# EAGLE design cartrack (EAGLE 6.6.0)
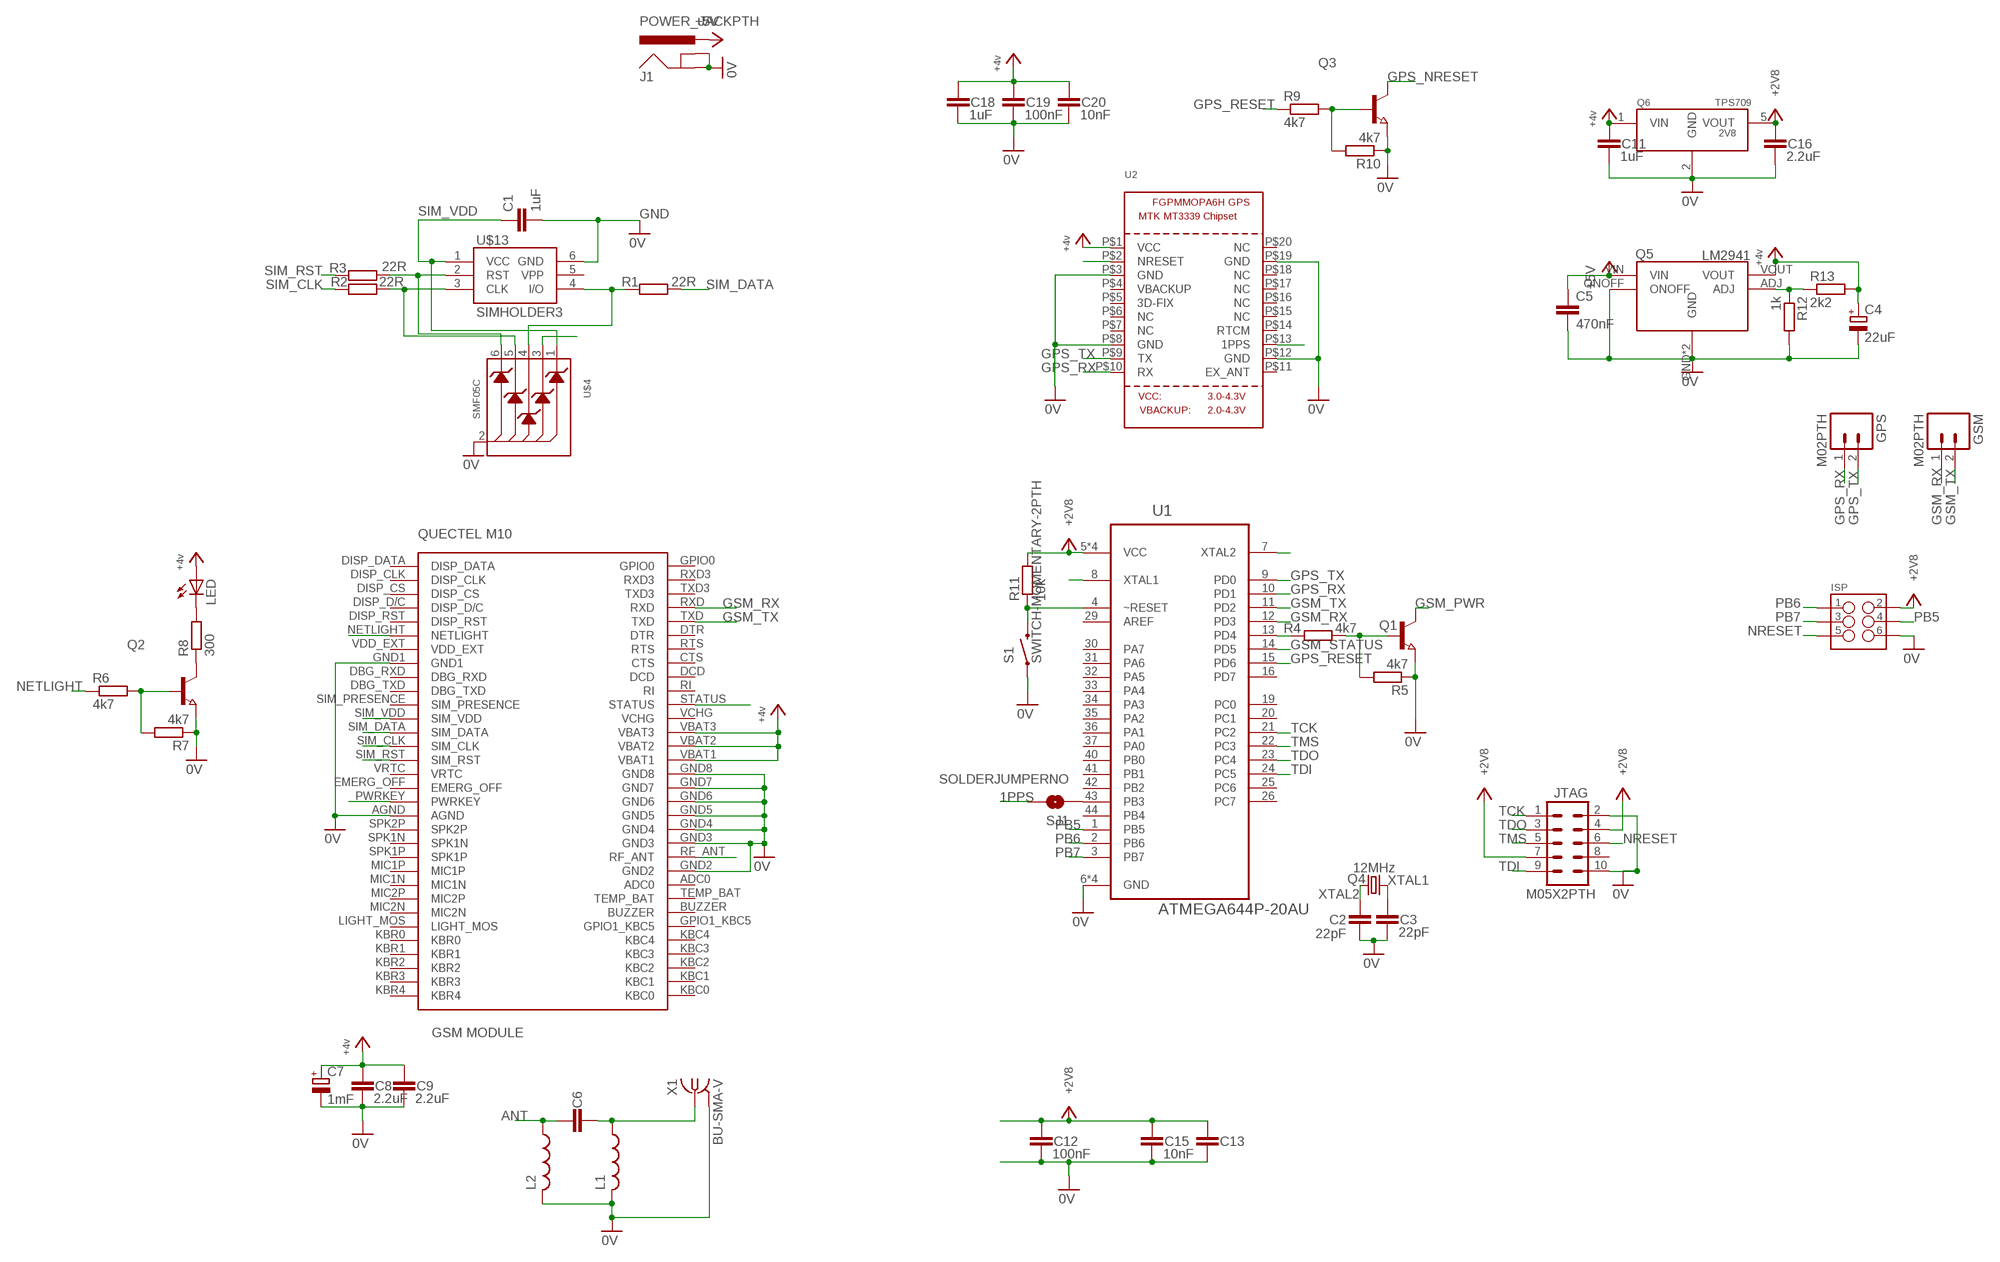
[diagram p0: schematic, sheet 1]

## Parts
C1  1uF  C-EUC0603  [C0603]
C2  22pF  CAP0603-CAP  [0603-CAP]
C3  22pF  CAP0603-CAP  [0603-CAP]
C4  22uF  CPOL-EUE3.5-8  [E3,5-8]
C5  470nF  C-EU025-024X044  [C025-024X044]
C6  CAP0603-CAP  [0603-CAP]
C7  1mF  CPOL-EUE3.5-8  [E3,5-8]
C8  2.2uF  CAP1206  [1206]
C9  2.2uF  CAP1206  [1206]
C11  1uF  CAP1206  [1206]
C12  100nF  CAP1206  [1206]
C13  CAP0603-CAP  [0603-CAP]
C15  10nF  CAP0603-CAP  [0603-CAP]
C16  2.2uF  CAP1206  [1206]
C18  1uF  CAPPTH  [CAP-PTH-SMALL]
C19  100nF  CAP1206  [1206]
C20  10nF  CAP0603-CAP  [0603-CAP]
GPS  M02PTH  [1X02]
GSM  M02PTH  [1X02]
ISP  M03X2NO_SILK  [2X3-NS]
J1  POWER_JACKPTH  [POWER_JACK_PTH]
JTAG  M05X2PTH  [AVR_ICSP]
L1  L-USL2012C  [L2012C]
L2  L-USL2012C  [L2012C]
LED  LEDSML0603  [SML0603]
Q1  NPN-TRANSISTOR_SOT23W  [SOT23W]
Q2  NPN-TRANSISTOR_SOT23W  [SOT23W]
Q3  NPN-TRANSISTOR_SOT23W  [SOT23W]
Q4  12MHz  CRYSTALSM49  [SM49]
Q5  LM2941  [LM2941]
Q6  TPS70928  [SOT23-5]
R1  22R  R-EU_R0603  [R0603]
R2  22R  R-EU_R0603  [R0603]
R3  22R  R-EU_R0603  [R0603]
R4  4k7  R-EU_R0603  [R0603]
R5  4k7  R-EU_R0603  [R0603]
R6  4k7  R-EU_R0603  [R0603]
R7  4k7  R-EU_R0603  [R0603]
R8  300  R-EU_R0603  [R0603]
R9  4k7  R-EU_R0603  [R0603]
R10  4k7  R-EU_R0603  [R0603]
R11  10k  R-EU_R0603  [R0603]
R12  1k  R-EU_R0603  [R0603]
R13  2k2  R-EU_R0603  [R0603]
S1  SWITCH-MOMENTARY-2PTH  [TACTILE-PTH]
SJ1  SOLDERJUMPERNO  [SJ_2S-NO]
U1  ATMEGA644P-20AU  [QFP80P1200X1200X120-44N]
U2  GPS_FGPMMOPA6H  [FGPMMOPA6H]
U$1  QUECTELM10  [QUECTELM10]
U$4  SMF05C  [SC-88]
U$13  SIMHOLDER3  [SIMHOLDER3]
X1  BU-SMA-V  [BU-SMA-V]

## Nets
1PPS: SJ1.2 U2.P$13(1PPS)
+2V8: C12.1 C13.1 C15.1 C16.1 ISP.2 JTAG.4 JTAG.7 Q6.5(VOUT) R11.2 U1.5(VCC) U1.17(VCC) U1.27(VCC) U1.38(VCC)
+4V: C4.+ C7.+ C8.1 C9.1 C11.1 C18.1 C19.1 C20.1 LED.A Q5.VOUT Q6.1(VIN) R13.2 U2.P$1(VCC) U$1.VBAT1 U$1.VBAT2 U$1.VBAT3
+5V: C5.1 J1.PWR Q5.VIN
ANT: C6.1 L2.1 U$1.RF_ANT
ANT_1: C6.2 L1.1 X1.1
GND: C1.2 C2.2 C3.2 C4.- C5.2 C7.- C8.2 C9.2 C11.2 C12.2 C13.2 C15.2 C16.2 C18.2 C19.2 C20.2 ISP.6 J1.GND J1.GNDBREAK JTAG.2 JTAG.10 L1.2 L2.2 Q1.3(E) Q2.3(E) Q3.3(E) Q5.GND Q5.ONOFF Q5.TAB(GND) Q6.2(GND) R5.1 R7.1 R10.1 R12.2 S1.1 U2.P$3(GND) U2.P$8(GND) U2.P$12(GND) U2.P$19(GND) U$1.AGND U$1.GND1 U$1.GND2 U$1.GND3 U$1.GND4 U$1.GND5 U$1.GND6 U$1.GND7 U$1.GND8 U$4.2(ANODE) U$13.6(GND) X1.2 X1.3 X1.4 X1.5 ; supply symbol labelled 0V
GPS_NRESET: Q3.2(C) U2.P$2(NRESET)
GPS_RESET: R9.1 U1.15(PD6)
GPS_RX: GPS.1 U1.10(PD1) U2.P$10(RX)
GPS_TX: GPS.2 U1.9(PD0) U2.P$9(TX)
GSM_PWR: Q1.2(C) U$1.PWRKEY U$4.3(CATODE2)
GSM_RX: GSM.1 U1.12(PD3) U$1.RXD
GSM_STATUS: U1.14(PD5) U$1.STATUS
GSM_TX: GSM.2 U1.11(PD2) U$1.TXD
N$5: Q1.1(B) R4.2 R5.2
N$6: R4.1 U1.13(PD4)
N$7: Q5.ADJ R12.1 R13.1
N$8: Q2.1(B) R6.2 R7.2
N$9: Q2.2(C) R8.1
N$10: LED.C R8.2
N$11: Q3.1(B) R9.2 R10.2
N$13: SJ1.1 U1.43(PB3)
NETLIGHT: R6.1 U$1.NETLIGHT
NRESET: ISP.5 JTAG.6 R11.1 S1.3 U1.4(~RESET)
PB5: ISP.4 U1.1(PB5)
PB6: ISP.1 U1.2(PB6)
PB7: ISP.3 U1.3(PB7)
SIM_CLK: R2.1 U$1.SIM_CLK
SIM_CLK_R: R2.2 U$4.5(CATODE4) U$13.3(CLK)
SIM_DATA: R1.2 U$1.SIM_DATA
SIM_DATA_R: R1.1 U$4.4(CATODE3) U$13.4(I/O)
SIM_RST: R3.1 U$1.SIM_RST
SIM_RST_R: R3.2 U$4.6(CATODE5) U$13.2(RST)
SIM_VDD: C1.1 U$1.SIM_VDD U$4.1(CATODE1) U$13.1(VCC)
TCK: JTAG.1 U1.21(PC2)
TDI: JTAG.9 U1.24(PC5)
TDO: JTAG.3 U1.23(PC4)
TMS: JTAG.5 U1.22(PC3)
XTAL1: C3.1 Q4.2 U1.8(XTAL1)
XTAL2: C2.1 Q4.1 U1.7(XTAL2)
Unconnected: JTAG.8 U1.6(GND) U1.16(PD7) U1.18(GND) U1.19(PC0) U1.20(PC1) U1.25(PC6) U1.26(PC7) U1.28(GND) U1.29(AREF) U1.30(PA7) U1.31(PA6) U1.32(PA5) U1.33(PA4) U1.34(PA3) U1.35(PA2) U1.36(PA1) U1.37(PA0) U1.39(GND) U1.40(PB0) U1.41(PB1) U1.42(PB2) U1.44(PB4) U2.P$4(VBACKUP) U2.P$5(3D-FIX) U2.P$6(NC) U2.P$7(NC) U2.P$11(EX_ANT) U2.P$14(RTCM) U2.P$15(NC) U2.P$16(NC) U2.P$17(NC) U2.P$18(NC) U2.P$20(NC) U$1.ADC0 U$1.BUZZER U$1.CTS U$1.DBG_RXD U$1.DBG_TXD U$1.DCD U$1.DISP_CLK U$1.DISP_CS U$1.DISP_D/C U$1.DISP_DATA U$1.DISP_RST U$1.DTR U$1.EMERG_OFF U$1.GPIO0 U$1.GPIO1_KBC5 U$1.KBC0 U$1.KBC1 U$1.KBC2 U$1.KBC3 U$1.KBC4 U$1.KBR0 U$1.KBR1 U$1.KBR2 U$1.KBR3 U$1.KBR4 U$1.LIGHT_MOS U$1.MIC1N U$1.MIC1P U$1.MIC2N U$1.MIC2P U$1.RI U$1.RTS U$1.RXD3 U$1.SIM_PRESENCE U$1.SPK1N U$1.SPK1P U$1.SPK2P U$1.TEMP_BAT U$1.TXD3 U$1.VCHG U$1.VDD_EXT U$1.VRTC U$13.5(VPP)

## Library data of the parts
C1 C5 = resistor:C-EU: CAPACITOR, European symbol
C2 C3 C6 C8 C9 C11-C13 C15 C16 C18-C20 = SparkFun-Passives:CAP: Capacitor Standard 0603 ceramic capacitor, and 0.1" leaded capacitor.
C4 C7 = resistor:CPOL-EU: POLARIZED CAPACITOR, European symbol
GPS GSM = SparkFun-Connectors:M02: Standard 2-pin 0.1" header. Use with - straight break away headers ( PRT-00116) - right angle break away headers (PRT-00553) - swiss pins (PRT-00743) - machine pins (PRT-00117) - female headers (PRT-00115) Molex polarized connector foot print use with: PRT-08233 with associated crimp pins and housings. 2.54_SCREWTERM for use with PRT-10571. 3.5mm Screw Terminal footprints for PRT-08084 5mm Screw Terminal footprints for use with PRT-08433
ISP = SparkFun-Connectors:M03X2: 2x3 .1" header. Shrouded, with keying- CONN-10681 SMT- CONN-11415 Pogo pins- HW-11044
J1 = SparkFun-Connectors:POWER_JACK: Power Jack This is the standard 5.5mm barrel jack for power. The PTH is the most common, proven, reliable, footprint. The Slot footprint only works if the mill layer is transmitted to the PCB fab house so be warned. Mating wall wart : TOL-00298 (and others); PROD_ID: PRT-00119
JTAG = SparkFun-Connectors:M05X2: Header 5x2 Standard 10-pin dual row 0.1" header. Commonly used with AVR-ISP. Use with Spark Fun Electronics SKU: PRT-00778
L1 L2 = resistor:L-US: INDUCTOR, American symbol
LED = led:LED: LED OSRAM: - CHIPLED LG R971, LG N971, LY N971, LG Q971, LY Q971, LO R971, LY R971 LH N974, LH R974 LS Q976, LO Q976, LY Q976 LO Q996 - Hyper CHIPLED LW Q18S LB Q993, LB Q99A, LB R99A - SideLED LS A670, LO A670, LY A670, LG A670, LP A670 LB A673, LV A673, LT A673, LW A673 LH A674 LY A675 LS A676, LA A676, LO A676, LY A676, LW A676 LS A679, LY A679, LG A679 - Hyper Micro SIDELED® LS Y876, LA Y876, LO Y876, LY Y876 LT Y87S - SmartLED LW L88C, LW L88S LB L89C, LB L89S, LG L890 LS L89K, LO L89K, LY L89K LS L896, LA L896, LO L896, LY L896 - TOPLED LS T670, LO T670, LY T670, LG T670, LP T670 LSG T670, LSP T670, LSY T670, LOP T670, LYG T670 LG T671, LOG T671, LSG T671 LB T673, LV T673, LT T673, LW T673 LH T674 LS T676, LA T676, LO T676, LY T676, LB T676, LH T676, LSB T676, LW T676 LB T67C, LV T67C, LT T67C, LS T67K, LO T67K, LY T67K, LW E67C LS E67B, LA E67B, LO E67B, LY E67B, LB E67C, LV E67C, LT E67C LW T67C LS T679, LY T679, LG T679 LS T770, LO T770, LY T770, LG T770, LP T770 LB T773, LV T773, LT T773, LW T773 LH T774 LS E675, LA E675, LY E675, LS T675 LS T776, LA T776, LO T776, LY T776, LB T776 LHGB T686 LT T68C, LB T68C - Hyper Mini TOPLED® LB M676 - Mini TOPLED Santana® LG M470 LS M47K, LO M47K, LY M47K Source: http://www.osram.convergy.de LUXEON: - LUMILED® LXK2-PW12-R00, LXK2-PW12-S00, LXK2-PW14-U00, LXK2-PW14-V00 LXK2-PM12-R00, LXK2-PM12-S00, LXK2-PM14-U00 LXK2-PE12-Q00, LXK2-PE12-R00, LXK2-PE12-S00, LXK2-PE14-T00, LXK2-PE14-U00 LXK2-PB12-K00, LXK2-PB12-L00, LXK2-PB12-M00, LXK2-PB14-N00, LXK2-PB14-P00, LXK2-PB14-Q00 LXK2-PR12-L00, LXK2-PR12-M00, LXK2-PR14-Q00, LXK2-PR14-R00 LXK2-PD12-Q00, LXK2-PD12-R00, LXK2-PD12-S00 LXK2-PH12-R00, LXK2-PH12-S00 LXK2-PL12-P00, LXK2-PL12-Q00, LXK2-PL12-R00 Source: www.luxeon.com KINGBRIGHT: KA-3528ASYC Source: www.kingbright.com
Q1-Q3 = semicon-smd-ipc:NPN-TRANSISTOR_: NPN TRANSISTOR
Q4 = crystal:CRYSTAL: CRYSTAL; OC_FARNELL: unknown; OC_NEWARK: unknown
Q5 = misc:LM2941: Voltage Regulator
Q6 = misc:TPS70928
R1-R13 = resistor:R-EU_: RESISTOR, European symbol
S1 = SparkFun-Electromechanical:SWITCH-MOMENTARY-2: Various NO switches- pushbuttons, reed, etc
SJ1 = SparkFun-Retired:SOLDERJUMPER: Solder Jumper Standard SMD solder jumper. Used to automate production. Two varients : Normally Open and Normally Closed are the same, but have different paste layers. NC will have a large amount of paste and should jumper during reflow.
U1 = Atmel_By_element14_Batch_1:ATMEGA644P-20AU: 8-bit Microcontroller with Bytes In-System Programmable Flash; MPN: ATMEGA644P-20AU; OC_FARNELL: 1455121; OC_NEWARK: 58M3746; PACKAGE: TQFP-44; SUPPLIER: Atmel
U2 = adafruit:GPS_FGPMMOPA6H: GPS Module - MTK MT3339 Chipset, -165dBm sensitivity, 22 channels, 10Hz, auto-select external antenna options
U$1 = quectelm10:QUECTELM10: Quectel M10 GSM module by RobotSzoft Kft
U$4 = Simplex-DiscreteSemi:SMF05C: ON Semiconductor SMF05C 5-line transient voltage suppressor array
U$13 = SparkFun-Connectors:SIMHOLDER3: Alternate SIM card socket
X1 = con-coax:BU-SMA-V: FEMALE SMA CONNECTOR Radiall distributor RS 112-3794; OC_FARNELL: unknown; OC_NEWARK: unknown

## Board
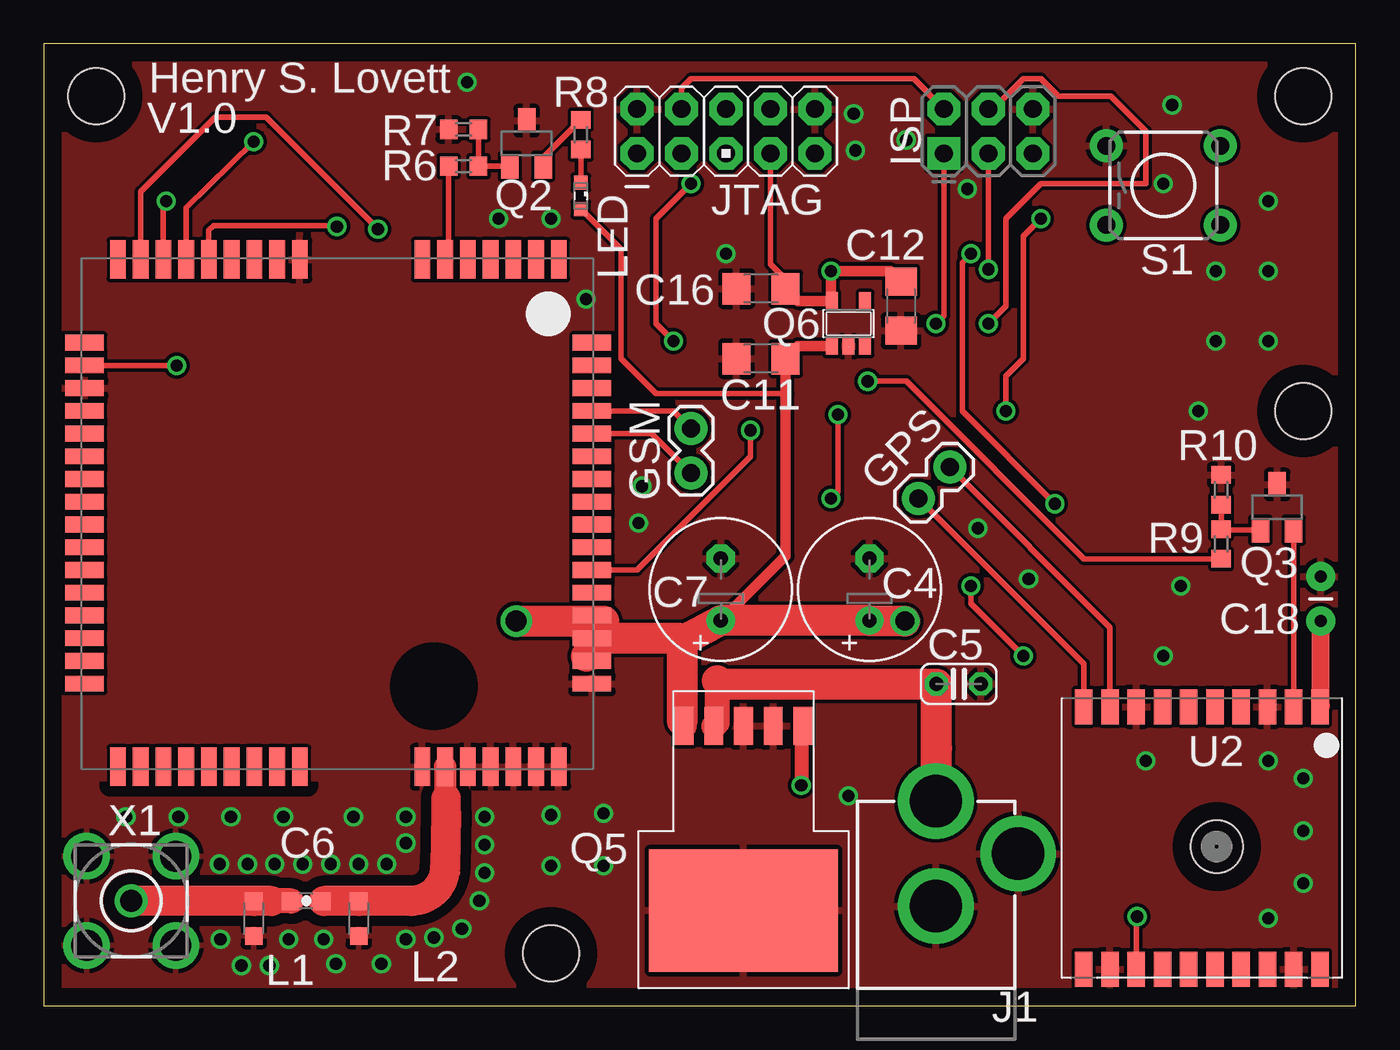
[diagram p1: board, top side]
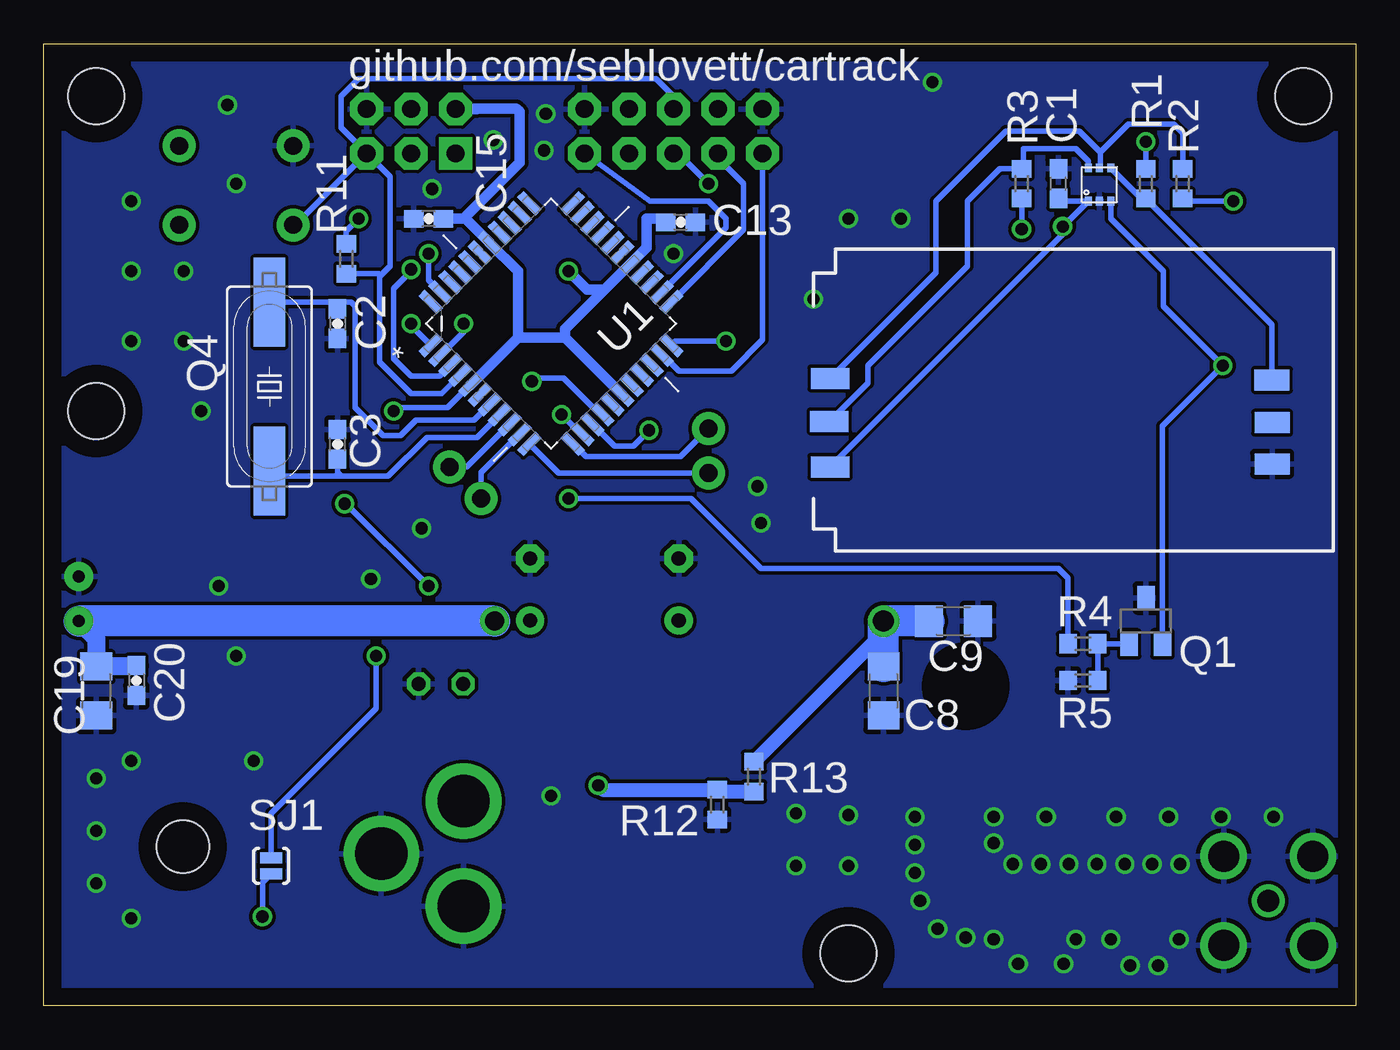
[diagram p2: board, bottom side, seen from below]

Size 75 x 55 mm. Coordinates in mm from the lower left corner, seen from the top.
Outline: 0,0 75,0 75,55 0,55 0,0
Copper layers (1*16): Top 0.035mm / dielectric 1.5mm / Bottom 0.035mm
Design rules "default": minimum track width 10mil, minimum drill 24mil, track to track 8mil, track to pad 8mil, pad to pad 8mil, via to via 8mil, smd to smd 8mil, copper to edge 40mil, drill to drill 8mil, minimum pad ring 10mil, minimum via ring 8mil, stop-mask expansion 4mil, vias tented up to drill 0mil, thermal gap 10mil
Holes 3.2 mm at 3,52 72,52 72,34 29,3

### Footprints (pad centres in the part's own frame; a part is rotated, then mirrored left to right if it is on the bottom)
C0603 = smd 1.1 x 1: 1 -0.85,0; 2 0.85,0
0603-CAP = smd 1.1 x 1: 1 -0.85,0; 2 0.85,0
E3,5-8 = drill 0.813 pad 1.6: + -1.778,0 | drill 0.813 pad 1.6 octagon: - 1.778,0
C025-024X044 = drill 0.813 octagon: 1 -1.27,0; 2 1.27,0
1206 = smd 1.6 x 1.8: 1 -1.4,0; 2 1.4,0
CAP-PTH-SMALL = drill 0.7 pad 1.651: 1 0,0; 2 2.54,0
1X02 = drill 1.016 pad 1.88: 1 0,0; 2 2.54,0
2X3-NS = drill 1.016 pad 1.88 square: 1 -2.54,-1.27 | drill 1.016 pad 1.88 octagon: 2 -2.54,1.27; 3 0,-1.27; 4 0,1.27; 5 2.54,-1.27; 6 2.54,1.27
POWER_JACK_PTH = drill 2.997 pad 4.318: GND 0,7.7; GNDBREAK 4.7,10.7; PWR 0,13.7
AVR_ICSP = drill 1.016 pad 1.88 octagon: 1 -1.27,5.08; 2 1.27,5.08; 3 -1.27,2.54; 4 1.27,2.54; 5 -1.27,0; 6 1.27,0; 7 -1.27,-2.54; 8 1.27,-2.54; 9 -1.27,-5.08; 10 1.27,-5.08
L2012C = smd 1 x 1: 1 -1,0; 2 1,0
SML0603 = smd 0.8 x 0.8: A 0.75,0; C -0.75,0
SOT23W = smd 1 x 1.4: 1 -0.95,-1.303; 2 0.95,-1.303; 3 0,1.303
SM49 = smd 5.08 x 1.778: 1 -4.826,0; 2 4.826,0
LM2941 = smd 2.184 x 1.067: ADJ 7,-3.4; GND 7,0; ONOFF 7,-1.7; VIN 7,1.7; VOUT 7,3.4 | smd 6.985 x 10.795: TAB -3.556,0
SOT23-5 = smd 0.69 x 0.99: 1 -0.95,-1.29; 2 0,-1.29; 3 0.95,-1.29; 4 0.95,1.3; 5 -0.95,1.3
R0603 = smd 1 x 1.1: 1 -0.85,0; 2 0.85,0
TACTILE-PTH = drill 1.016 pad 1.88: 1 -3.251,2.261; 2 3.251,2.261; 3 -3.251,-2.261; 4 3.251,-2.261
SJ_2S-NO = smd 0.635 x 1.27: 1 -0.45,0; 2 0.45,0
QFP80P1200X1200X120-44N = smd 1.473 x 0.508: 1 -5.74,3.988; 2 -5.74,3.2; 3 -5.74,2.388; 4 -5.74,1.6; 5 -5.74,0.787; 6 -5.74,0; 7 -5.74,-0.787; 8 -5.74,-1.6; 9 -5.74,-2.388; 10 -5.74,-3.2; 11 -5.74,-3.988; 23 5.74,-3.988; 24 5.74,-3.2; 25 5.74,-2.388; 26 5.74,-1.6; 27 5.74,-0.787; 28 5.74,0; 29 5.74,0.787; 30 5.74,1.6; 31 5.74,2.388; 32 5.74,3.2; 33 5.74,3.988 | smd 0.508 x 1.473: 12 -3.988,-5.74; 13 -3.2,-5.74; 14 -2.388,-5.74; 15 -1.6,-5.74; 16 -0.787,-5.74; 17 0,-5.74; 18 0.787,-5.74; 19 1.6,-5.74; 20 2.388,-5.74; 21 3.2,-5.74; 22 3.988,-5.74; 34 3.988,5.74; 35 3.2,5.74; 36 2.388,5.74; 37 1.6,5.74; 38 0.787,5.74; 39 0,5.74; 40 -0.787,5.74; 41 -1.6,5.74; 42 -2.388,5.74; 43 -3.2,5.74; 44 -3.988,5.74
FGPMMOPA6H = smd 2 x 1: P$1 -7.5,6.75; P$2 -7.5,5.25; P$3 -7.5,3.75; P$4 -7.5,2.25; P$5 -7.5,0.75; P$6 -7.5,-0.75; P$7 -7.5,-2.25; P$8 -7.5,-3.75; P$9 -7.5,-5.25; P$10 -7.5,-6.75; P$11 7.5,-6.75; P$12 7.5,-5.25; P$13 7.5,-3.75; P$14 7.5,-2.25; P$15 7.5,-0.75; P$16 7.5,0.75; P$17 7.5,2.25; P$18 7.5,3.75; P$19 7.5,5.25; P$20 7.5,6.75 | hole 3: 0.5,0.85
QUECTELM10 = smd 2.2 x 0.9: ADC0 15.1,-2.15; BUZZER 15.1,-4.75; DBG_RXD -13.9,-3.45; DBG_TXD -13.9,-4.75; DISP_CLK -13.9,11.35; DISP_CS -13.9,10.05; DISP_D/C -13.9,8.75; DISP_DATA -13.9,12.65; DISP_RST -13.9,7.45; GND1 -13.9,-2.15; GND2 15.1,4.85; GND3 15.1,7.45; GND4 15.1,8.75; GND5 15.1,10.05; GND6 15.1,11.35; GND7 15.1,12.65; GPIO1_KBC5 15.1,-6.05; KBC0 15.1,-12.55; KBC1 15.1,-11.25; KBC2 15.1,-9.95; KBC3 15.1,-8.65; KBC4 15.1,-7.35; NETLIGHT -13.9,6.15; RF_ANT 15.1,6.15; SIM_CLK -13.9,-9.95; SIM_DATA -13.9,-8.65; SIM_PRESENCE -13.9,-6.05; SIM_RST -13.9,-11.25; SIM_VDD -13.9,-7.35; TEMP_BAT 15.1,-3.45; VDD_EXT -13.9,4.85; VRTC -13.9,-12.55 | smd 0.9 x 2.2: AGND -6.55,-14.45; CTS -0.05,14.55; DCD 1.25,14.55; DTR -2.65,14.55; EMERG_OFF -9.15,-14.45; GND8 10.35,14.55; GPIO0 -9.15,14.55; KBR0 5.15,-14.45; KBR1 6.45,-14.45; KBR2 7.75,-14.45; KBR3 9.05,-14.45; KBR4 10.35,-14.45; LIGHT_MOS 3.85,-14.45; MIC1N -0.05,-14.45; MIC1P -1.35,-14.45; MIC2N 2.55,-14.45; MIC2P 1.25,-14.45; PWRKEY -7.85,-14.45; RI 2.55,14.55; RTS -1.35,14.55; RXD -5.25,14.55; RXD3 -7.85,14.55; SPK1N -3.95,-14.45; SPK1P -2.65,-14.45; SPK2P -5.25,-14.45; STATUS 3.85,14.55; TXD -3.95,14.55; TXD3 -6.55,14.55; VBAT1 9.05,14.55; VBAT2 7.75,14.55; VBAT3 6.45,14.55; VCHG 5.15,14.55
SC-88 = smd 0.5 x 0.4: 1 0,1.3; 2 0,0.65; 3 0,0; 4 1.9,0; 5 1.9,0.65; 6 1.9,1.3
SIMHOLDER3 = smd 2.2 x 1.2: 1 0.95,4.81; 2 0.91,7.41; 3 0.95,9.86 | smd 2 x 1.2: 4 26.2,9.78; 5 26.22,7.34; 6 26.22,4.98
BU-SMA-V = drill 1.27: 1 0,0 | drill 1.778: 2 -2.55,2.55; 3 2.55,2.55; 4 2.55,-2.55; 5 -2.55,-2.55

### Placement (x,y rotation side)
C1  17,47 90 bottom
C2  58.2,39 270 bottom
C3  58.2,32.1 90 bottom
C4  47.2,23.8 90 top
C5  52.3,18.4 0 top
C6  15,6 180 top
C7  38.7,23.8 90 top
C8  27,18 270 bottom
C9  23,22 0 bottom
C11  41,37 180 top
C12  49,40 270 top
C13  38.6,44.8 0 bottom
C15  53,45 180 bottom
C16  41,41 180 top
C18  73,22 90 top
C19  72,18 270 bottom
C20  69.7,18.6 270 bottom
GPS  50,29 45 top
GSM  37,33 270 top
ISP  54,50 0 top
J1  51,-2 0 top
JTAG  39,50 90 top
L1  12,5 270 top
L2  18,5 270 top
LED  30.7,46.3 270 top
Q1  12,22 0 bottom
Q2  27.6,49.3 0 top
Q3  70.5,28.5 0 top
Q4  62.1,35.4 270 bottom
Q5  40,9 90 top
Q6  46,39 0 top
R1  12,47 90 bottom
R2  9.9,47 90 bottom
R3  19.1,47 90 bottom
R4  15.6,20.7 0 bottom
R5  15.6,18.6 0 bottom
R6  24,48 0 top
R7  24,50.1 0 top
R8  30.7,49.8 270 top
R9  67.3,26.4 90 top
R10  67.3,29.5 270 top
R11  57.7,42.7 90 bottom
R12  36.5,11.5 270 bottom
R13  34.4,13.1 90 bottom
S1  64,46.9 0 top
SJ1  62,8 270 bottom
U1  46,39 45 bottom
U2  66.2,9.6 270 top
U$1  16.79,28.76 270 top
U$4  14,46 90 bottom
U$13  31,26 0 bottom
X1  5,6 0 top

### Tracks (layer width: path | path; a pad name or v marks a point on that pad's centre or on a via)
1PPS  (via drill 0.7)
  Top 0.305: v62.5,5.1 62.45,5.05 U2.P$13
  Bottom 0.305: SJ1.2 62.5,7.05 v62.5,5.1
+2V8  (via drill 0.7)
  Top 0.305: JTAG.7 41.54,42.4 43,40.94 42.46,40.94 C16.1 | JTAG.4 36.46,52.46 37,53 49.73,53 ISP.2 | v57,45 56,44 56,37 55,36 v55,34
  Top 0.61: C16.1 43.1,40.3 Q6.5 45,40.35 v45,42 48.4,42 C12.1
  Bottom 0.305: R11.2 57.7,44.3 v57,45 | v55,34 54.8,34.2 51.91,34.2 U1.5
  Bottom 0.61: U1.5 50.6,35.5 47.9,38.2 | 47.9,38.2 47.9,42 49.5,43.6 U1.38 50.89,45 | U1.17 45.2,38.2 | 45.2,38.2 47.9,38.2 | 45.2,38.2 45.2,38.69 42.94,40.94 | 42.94,40.94 U1.27 40.54,43.35 40.54,45 39.65,45 C13.1 | 50.27,51.27 ISP.2 51.43,51.3 48,51.3 47.8,51.1 47.8,48.2 50.89,45.11 50.89,45 | v45,42 43.94,40.94 42.94,40.94 | 50.89,45 C15.1
+4V  (via drill 1.1, 1.2)
  Top 0.305: LED.A 33,43.25 33,37 35,35 42.4,35
  Top 0.61: C7.+ 42.4,25.72 42.4,35 C11.1 43.11,37.71 Q6.1
  Top 0.813: 31,22 31.31,22.31 U$1.VBAT3
  Top 1.016: U$1.VBAT1 31.05,20 | U2.P$1 73,17.15 C18.1
  Top 1.422: Q5.VOUT 36.5,16.3 | 31,22 31,21.35 31,20
  Top 1.778: 36.5,16.3 36.5,20.9 | 36.5,20.9 36.29,21.01 U$1.VBAT2 | U$1.VBAT2 31,21.35 | 31.05,20 31,20 | 36.5,20.9 37,21.12 C7.+ C4.+ v49.22,22 | v27,22 31,22 32,22 31.34,21.34 U$1.VBAT2
  Bottom 0.813: R13.2 27,21.35 v27,22
  Bottom 1.016: C18.1 72,21 C19.1 69.75,19.4 C20.1
  Bottom 1.778: v49.22,22 C18.1 | C9.1 v27,22 C8.1
+5V
  Top 1.422: Q5.VIN 38.5,16.2 38.5,18.6
  Top 1.778: J1.PWR 51.03,14.73 C5.1 38.7,18.4 38.5,18.6
ANT
  Top 1.27: U$1.RF_ANT 22.95,12
  Top 1.422: 22.95,12 23,11.85 | 16,6 C6.1
  Top 1.676: 23,11.85 23,11
  Top 1.7: 23,11 22.94,7.94 arc-90 21,6 L2.1 16,6
ANT_1
  Top 1.422: C6.2 13,6
  Top 1.7: 13,6 L1.1 X1.1
GND  (via drill 0.7)
  other vias: 10.05,8.1 11.65,8.1 13.2,8.1 14.8,8.1 16.4,8.1 18,8.1 19.6,8.1 29,10.9 39,43 64,47 46.3,51 46.4,48.9 26,45 29,45 29,8 46,12 70,5 72,7 72,10 72,13 70,14 63,14 65,24 64,20 66,34 67,42 10.1,3.8 12.9,2.3 14,3.8 16,3.8 16.7,2.4 19.3,2.4 20.7,3.8 22.3,3.9 23.9,4.4 24.9,6 25.2,9.2 25.2,7.6 25.2,10.8 20.7,10.8 20.7,9.3 11.3,2.3 32,8 32,11 17.7,10.8 13.7,10.8 10.7,10.8 7.7,10.8 4.7,10.8 56.3,24.4 53.4,27.3 31,40.4 24.2,52.8 64.5,51.5 34,27.6 34.2,29.7 49.3,49.5 52.8,46.7 67,38 70,38 70,42 70,46
  pour Bottom: 0,55 75,55 75,0 0,0
  pour Top: 0,55 75,55 75,0 27,0 27,13 0,13
  pour Top (isolate 0.61): 27,0 27,13 0,13 0,0
GPS_NRESET
  Top 0.305: Q3.2 U2.P$2
GPS_RESET  (via drill 0.7)
  Top 0.305: v47.1,35.7 49.3,35.7 59.45,25.55 R9.1
  Bottom 0.305: U1.15 43.21,33.81 45.3,35.9 46.9,35.9 v47.1,35.7
GPS_RX
  Top 0.305: U2.P$10 59.45,19.55 GPS.1
  Bottom 0.305: U1.10 50,30.47 GPS.1
GPS_TX
  Top 0.305: U2.P$9 60.95,21.64 GPS.2
  Bottom 0.305: U1.9 50.83,30.8 GPS.2
GSM_PWR  (via drill 0.7)
  Top 0.305: U$1.PWRKEY v7.6,36.6
  Bottom 0.305: U$4.3 14,45 11,42 11,40 v7.6,36.6 11.05,33.15 Q1.2
GSM_RX
  Top 0.305: U$1.RXD 35.99,34.01 GSM.1
  Bottom 0.305: GSM.1 38.6,31.4 44,31.4 44.72,32.12 U1.12
GSM_STATUS  (via drill 0.7)
  Top 0.305: U$1.STATUS 33.91,24.91 40.4,31.4 v40.4,32.9
  Bottom 0.305: v40.4,32.9 41.3,32 42.38,32 U1.14
GSM_TX
  Top 0.305: U$1.TXD 34.75,32.71 GSM.2
  Bottom 0.305: GSM.2 45.58,30.46 U1.11
N$5
  Bottom 0.305: Q1.1 R4.2 R5.2
N$6  (via drill 0.7)
  Top 0.305: v45.4,33.8 45.4,29.4 v45,29
  Bottom 0.305: U1.13 44.28,32.68 v45.4,33.8 | v45,29 38,29 34,25 17,25 16.45,24.45 R4.1
N$7  (via drill 0.7)
  Top 0.61: Q5.ADJ 43.3,15.9
  Top 0.813: 43.3,15.9 v43.3,12.6
  Bottom 0.61: v43.3,12.6 43.05,12.35 | R12.1 36.4,12.25
  Bottom 0.813: 43.05,12.35 R12.1 | 36.4,12.25 R13.1
N$8
  Top 0.305: Q2.1 R6.2 R7.2
N$9
  Top 0.305: Q2.2 28.55,48.5 R8.1
N$10
  Top 0.305: R8.2 LED.C
N$11
  Top 0.305: Q3.1 67.35,27.2 R9.2 R10.2
N$13  (via drill 0.7)
  Top 0.305: v53,43 52.5,42.5 52.5,34 v57.8,28.7 | v53,24 53,23 v56,20
  Bottom 0.305: U1.43 53,41.47 v53,43 | v57.8,28.7 57.7,28.7 v53,24 | v56,20 56,17 62,11 SJ1.1
NETLIGHT
  Top 0.305: R6.1 23.15,42.87 U$1.NETLIGHT
NRESET
  Bottom 0.305: ISP.5 55.2,47.39 55.2,42.3 55.75,41.75 | 55.75,41.75 55.8,41.7 55.8,36.8 54,35 52.26,35 U1.4 | S1.3 60.83,44.44 ISP.5 | JTAG.6 39,52 40,53 57,53 58,52 58,50.19 ISP.5 | R11.1 55.85,41.85 55.75,41.75
PB5  (via drill 0.7)
  Top 0.305: v54,39 55,40 55,45 57,47 63,47 63,50 61,52 58,52 57,53 56,53 54.27,51.27 ISP.4 53.73,51.27
  Bottom 0.305: v54,39 54,38.88 U1.1
PB6  (via drill 0.7)
  Top 0.305: ISP.1 51.46,39.46 v51,39
  Bottom 0.305: v51,39 51,38.53 U1.2
PB7  (via drill 0.7)
  Top 0.305: ISP.3 v54,42.1
  Bottom 0.305: v54,42.1 54,42 55,41 55,37 54,36 52.38,36 U1.3
SIM_CLK  (via drill 0.7)
  Top 0.305: v7,46 6.84,45.84 U$1.SIM_CLK
  Bottom 0.305: R2.1 9.75,46 v7,46
SIM_CLK_R
  Bottom 0.305: U$4.5 14.6,47.95 14.6,48.8 | 14.6,48.8 13,50.4 10.4,50.4 9.9,49.9 R2.2 | U$13.3 24,41.91 24,46 20,50 15.8,50 14.6,48.8
SIM_DATA  (via drill 0.7)
  Top 0.305: v12,49.4 8.14,45.64 U$1.SIM_DATA
  Bottom 0.305: R1.2 v12,49.4
SIM_DATA_R
  Bottom 0.305: U$13.4 4.8,38.95 R1.1 12.25,46.15 U$4.4
SIM_RST  (via drill 0.7)
  Top 0.305: U$1.SIM_RST 5.54,46.54 9.8,50.8 12.7,50.8 v19.1,44.4
  Bottom 0.305: v19.1,44.4 R3.1
SIM_RST_R
  Bottom 0.305: U$4.6 15.3,48.3 16,49 19,49 19,47.95 R3.2 20.35,47.85 22.2,46 22.2,42.3 27.9,36.6 27.9,35.6 U$13.2
SIM_VDD  (via drill 0.7)
  Top 0.305: 9.4,42.62 U$1.SIM_VDD 9.44,44.34 9.7,44.6 16.7,44.6 v16.75,44.55
  Bottom 0.305: C1.1 16.85,46 U$4.1 v16.75,44.55 16.75,44.11 U$13.1
TCK
  Bottom 0.305: JTAG.1 33.92,38.08 35.7,36.3 38.7,36.3 39.6,37.2 U1.21
TDI
  Bottom 0.305: JTAG.9 40.35,46 37,46 36,45 36,44.5 36.47,44 U1.24
TDO
  Bottom 0.305: JTAG.3 36.46,48.46 35,47 35,44.36 U1.23
TMS  (via drill 0.7)
  Top 0.305: v37,47 35,45 35,39 v36,38
  Bottom 0.305: JTAG.5 39,49 v37,47 | v36,38 38.88,38 U1.22
XTAL1
  Bottom 0.305: Q4.2 61.8,30.27 58,30.27 | 58,30.27 55.33,30.27 53.1,32.5 50.24,32.5 U1.8 | C3.1 58.2,30.47 58,30.27
XTAL2
  Bottom 0.305: U1.7 49.89,33.9 50,33.9 50.4,33.5 53.7,33.5 54.6,32.6 55.6,32.6 57.2,34.2 57.2,40 57.43,40.23 58,40.23 | Q4.1 58,40.23 | C2.1 58.2,40.03 58,40.23

### Text on the board
tNames: Henry S. Lovett | V1.0
bNames: github.com/seblovett/cartrack